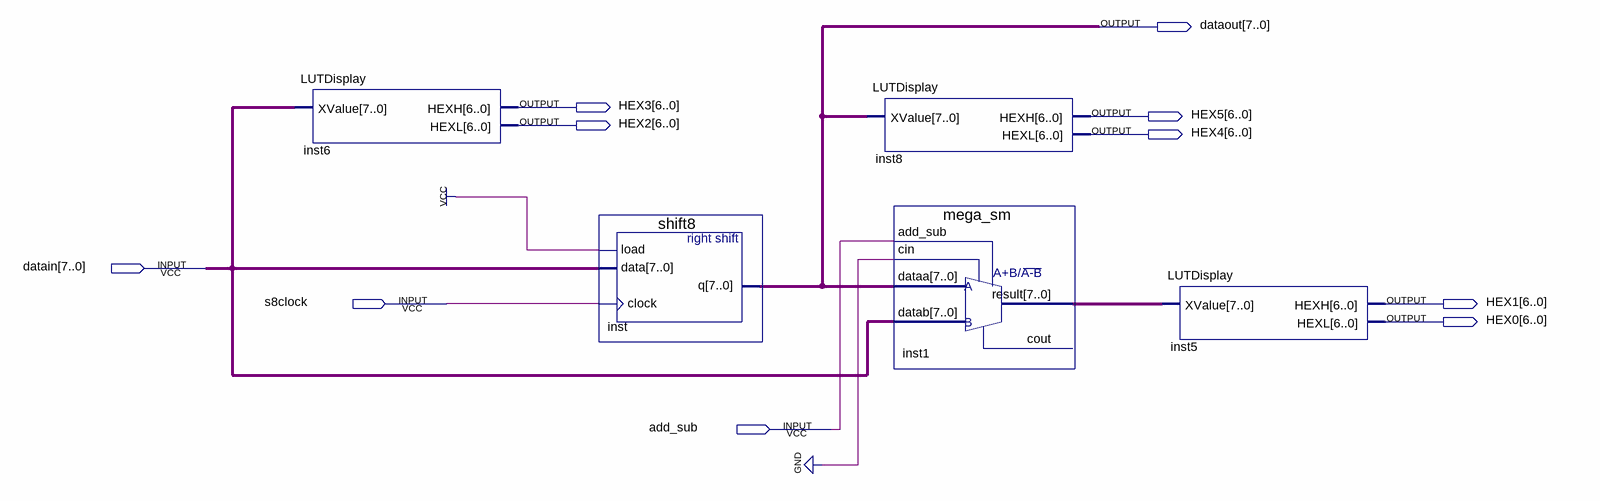
[diagram p0: schematic sheet]
// Quartus schematic cdlab5add.bdf as structural Verilog: 5 symbols, 10 pins
module cdlab5add (
  input  [7:0] datain,
  input  s8clock,
  input  add_sub,
  output [7:0] dataout,
  output [6:0] HEX3,
  output [6:0] HEX5,
  output [6:0] HEX2,
  output [6:0] HEX4,
  output [6:0] HEX1,
  output [6:0] HEX0
);

  wire [7:0] inst1_result;

  LUTDisplay inst6 (.XValue(datain), .HEXH(HEX3), .HEXL(HEX2));
  shift8 inst (.load(1'b1), .data(datain), .clock(s8clock), .q(dataout));
  LUTDisplay inst8 (.XValue(dataout), .HEXH(HEX5), .HEXL(HEX4));
  mega_sm inst1 (.cin(1'b0), .add_sub(add_sub), .dataa(dataout), .datab(datain), .result(inst1_result));  // open: cout
  LUTDisplay inst5 (.XValue(inst1_result), .HEXH(HEX1), .HEXL(HEX0));
endmodule
